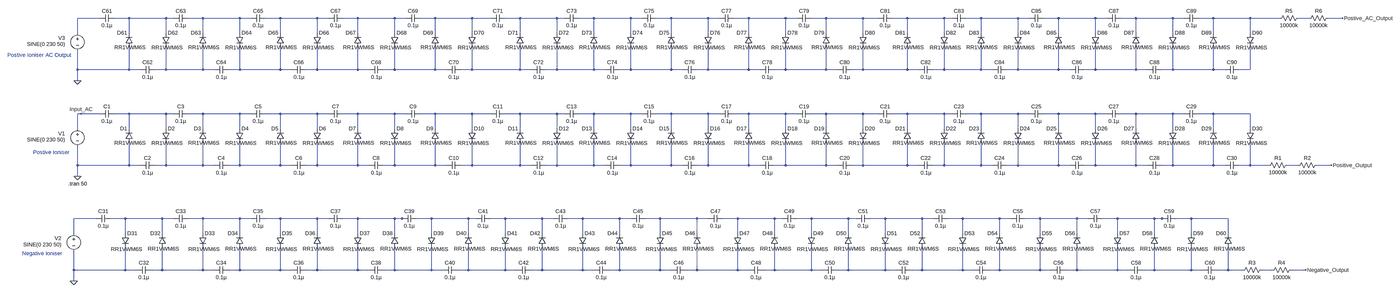
[diagram p0: schematic Ioniser_LTspice.asc, whole sheet]
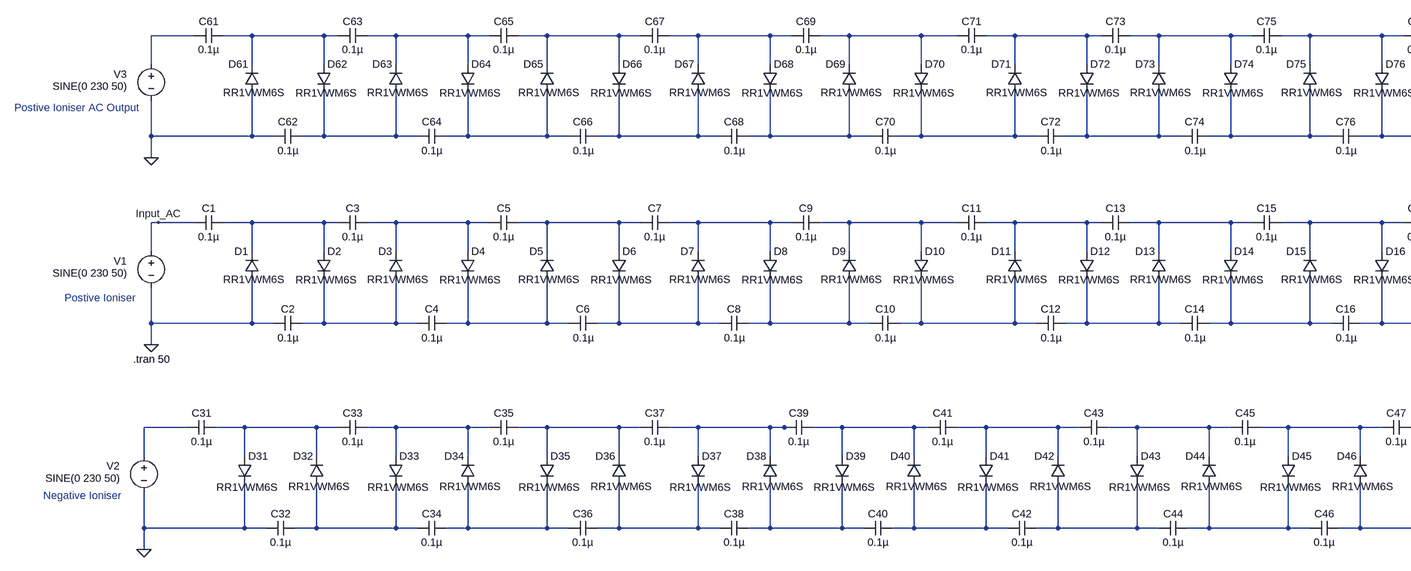
[diagram p1: schematic Ioniser_LTspice.asc, part, row 1 of 1, column 1 of 2]
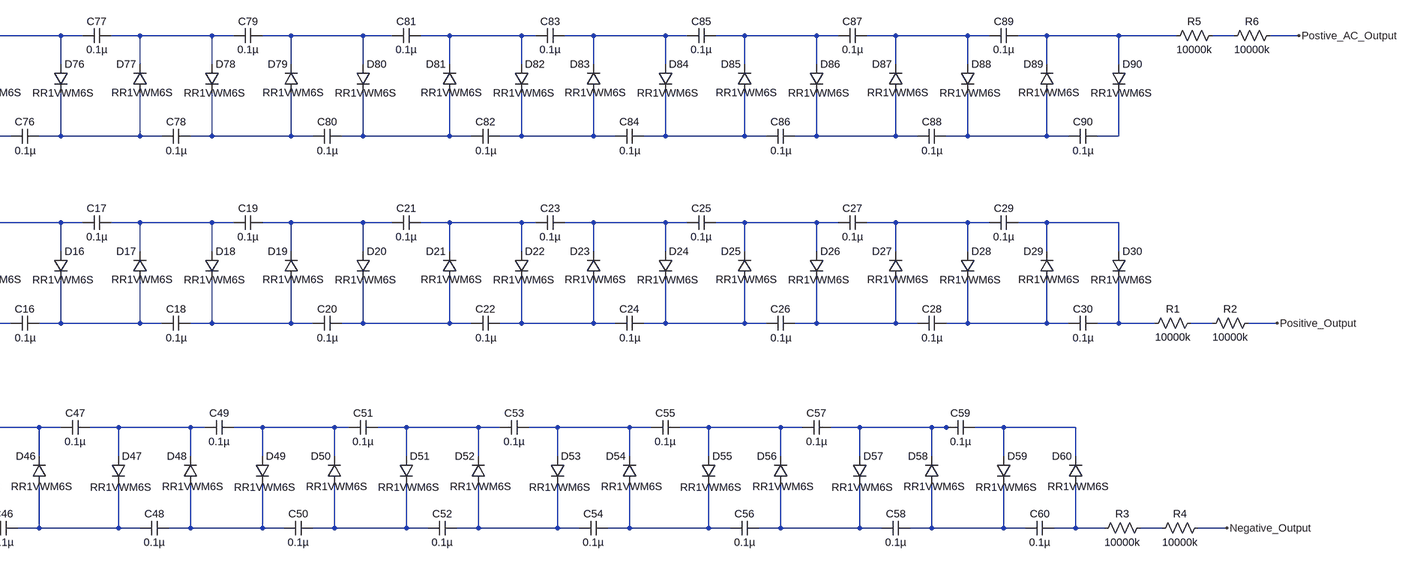
[diagram p2: schematic Ioniser_LTspice.asc, part, row 1 of 1, column 2 of 2]
* Ioniser_LTspice.asc
V1 Input_AC 0 SINE(0 230 50)
D1 0 N033 RR1VWM6S
C1 N033 Input_AC 0.1µ V=630 Irms=556m Rser=0.01433 Lser=0 mfg="KEMET" pn="C1812C104KBRAC" type="X7R"
D2 N033 N048 RR1VWM6S
C2 N048 0 0.1µ V=630 Irms=556m Rser=0.01433 Lser=0 mfg="KEMET" pn="C1812C104KBRAC" type="X7R"
D3 N048 N034 RR1VWM6S
C3 N034 N033 0.1µ V=630 Irms=556m Rser=0.01433 Lser=0 mfg="KEMET" pn="C1812C104KBRAC" type="X7R"
D4 N034 N049 RR1VWM6S
C4 N049 N048 0.1µ V=630 Irms=556m Rser=0.01433 Lser=0 mfg="KEMET" pn="C1812C104KBRAC" type="X7R"
D5 N049 N035 RR1VWM6S
C5 N035 N034 0.1µ V=630 Irms=556m Rser=0.01433 Lser=0 mfg="KEMET" pn="C1812C104KBRAC" type="X7R"
D6 N035 N050 RR1VWM6S
C6 N050 N049 0.1µ V=630 Irms=556m Rser=0.01433 Lser=0 mfg="KEMET" pn="C1812C104KBRAC" type="X7R"
D7 N050 N036 RR1VWM6S
C7 N036 N035 0.1µ V=630 Irms=556m Rser=0.01433 Lser=0 mfg="KEMET" pn="C1812C104KBRAC" type="X7R"
D8 N036 N051 RR1VWM6S
C8 N051 N050 0.1µ V=630 Irms=556m Rser=0.01433 Lser=0 mfg="KEMET" pn="C1812C104KBRAC" type="X7R"
R1 N063 N062 10000k
R2 Positive_Output N063 10000k
D9 N051 N037 RR1VWM6S
C9 N037 N036 0.1µ V=630 Irms=556m Rser=0.01433 Lser=0 mfg="KEMET" pn="C1812C104KBRAC" type="X7R"
D10 N037 N052 RR1VWM6S
C10 N052 N051 0.1µ V=630 Irms=556m Rser=0.01433 Lser=0 mfg="KEMET" pn="C1812C104KBRAC" type="X7R"
D11 N052 N038 RR1VWM6S
C11 N038 N037 0.1µ V=630 Irms=556m Rser=0.01433 Lser=0 mfg="KEMET" pn="C1812C104KBRAC" type="X7R"
D12 N038 N053 RR1VWM6S
C12 N053 N052 0.1µ V=630 Irms=556m Rser=0.01433 Lser=0 mfg="KEMET" pn="C1812C104KBRAC" type="X7R"
D13 N053 N039 RR1VWM6S
C13 N039 N038 0.1µ V=630 Irms=556m Rser=0.01433 Lser=0 mfg="KEMET" pn="C1812C104KBRAC" type="X7R"
D14 N039 N054 RR1VWM6S
C14 N054 N053 0.1µ V=630 Irms=556m Rser=0.01433 Lser=0 mfg="KEMET" pn="C1812C104KBRAC" type="X7R"
D15 N054 N040 RR1VWM6S
C15 N040 N039 0.1µ V=630 Irms=556m Rser=0.01433 Lser=0 mfg="KEMET" pn="C1812C104KBRAC" type="X7R"
D16 N040 N055 RR1VWM6S
C16 N055 N054 0.1µ V=630 Irms=556m Rser=0.01433 Lser=0 mfg="KEMET" pn="C1812C104KBRAC" type="X7R"
D17 N055 N041 RR1VWM6S
C17 N041 N040 0.1µ V=630 Irms=556m Rser=0.01433 Lser=0 mfg="KEMET" pn="C1812C104KBRAC" type="X7R"
D18 N041 N056 RR1VWM6S
C18 N056 N055 0.1µ V=630 Irms=556m Rser=0.01433 Lser=0 mfg="KEMET" pn="C1812C104KBRAC" type="X7R"
D19 N056 N042 RR1VWM6S
C19 N042 N041 0.1µ V=630 Irms=556m Rser=0.01433 Lser=0 mfg="KEMET" pn="C1812C104KBRAC" type="X7R"
D20 N042 N057 RR1VWM6S
C20 N057 N056 0.1µ V=630 Irms=556m Rser=0.01433 Lser=0 mfg="KEMET" pn="C1812C104KBRAC" type="X7R"
D21 N057 N043 RR1VWM6S
C21 N043 N042 0.1µ V=630 Irms=556m Rser=0.01433 Lser=0 mfg="KEMET" pn="C1812C104KBRAC" type="X7R"
D22 N043 N058 RR1VWM6S
C22 N058 N057 0.1µ V=630 Irms=556m Rser=0.01433 Lser=0 mfg="KEMET" pn="C1812C104KBRAC" type="X7R"
D23 N058 N044 RR1VWM6S
C23 N044 N043 0.1µ V=630 Irms=556m Rser=0.01433 Lser=0 mfg="KEMET" pn="C1812C104KBRAC" type="X7R"
D24 N044 N059 RR1VWM6S
C24 N059 N058 0.1µ V=630 Irms=556m Rser=0.01433 Lser=0 mfg="KEMET" pn="C1812C104KBRAC" type="X7R"
D25 N059 N045 RR1VWM6S
C25 N045 N044 0.1µ V=630 Irms=556m Rser=0.01433 Lser=0 mfg="KEMET" pn="C1812C104KBRAC" type="X7R"
D26 N045 N060 RR1VWM6S
C26 N060 N059 0.1µ V=630 Irms=556m Rser=0.01433 Lser=0 mfg="KEMET" pn="C1812C104KBRAC" type="X7R"
D27 N060 N046 RR1VWM6S
C27 N046 N045 0.1µ V=630 Irms=556m Rser=0.01433 Lser=0 mfg="KEMET" pn="C1812C104KBRAC" type="X7R"
D28 N046 N061 RR1VWM6S
C28 N061 N060 0.1µ V=630 Irms=556m Rser=0.01433 Lser=0 mfg="KEMET" pn="C1812C104KBRAC" type="X7R"
D29 N061 N047 RR1VWM6S
C29 N047 N046 0.1µ V=630 Irms=556m Rser=0.01433 Lser=0 mfg="KEMET" pn="C1812C104KBRAC" type="X7R"
D30 N047 N062 RR1VWM6S
C30 N062 N061 0.1µ V=630 Irms=556m Rser=0.01433 Lser=0 mfg="KEMET" pn="C1812C104KBRAC" type="X7R"
V2 N064 0 SINE(0 230 50)
D31 N065 0 RR1VWM6S
C31 N065 N064 0.1µ V=630 Irms=556m Rser=0.01433 Lser=0 mfg="KEMET" pn="C1812C104KBRAC" type="X7R"
C32 N080 0 0.1µ V=630 Irms=556m Rser=0.01433 Lser=0 mfg="KEMET" pn="C1812C104KBRAC" type="X7R"
D32 N080 N065 RR1VWM6S
D33 N066 N080 RR1VWM6S
C33 N066 N065 0.1µ V=630 Irms=556m Rser=0.01433 Lser=0 mfg="KEMET" pn="C1812C104KBRAC" type="X7R"
C34 N081 N080 0.1µ V=630 Irms=556m Rser=0.01433 Lser=0 mfg="KEMET" pn="C1812C104KBRAC" type="X7R"
D34 N081 N066 RR1VWM6S
D35 N067 N081 RR1VWM6S
C35 N067 N066 0.1µ V=630 Irms=556m Rser=0.01433 Lser=0 mfg="KEMET" pn="C1812C104KBRAC" type="X7R"
C36 N082 N081 0.1µ V=630 Irms=556m Rser=0.01433 Lser=0 mfg="KEMET" pn="C1812C104KBRAC" type="X7R"
D36 N082 N067 RR1VWM6S
D37 N068 N082 RR1VWM6S
C37 N068 N067 0.1µ V=630 Irms=556m Rser=0.01433 Lser=0 mfg="KEMET" pn="C1812C104KBRAC" type="X7R"
C38 N083 N082 0.1µ V=630 Irms=556m Rser=0.01433 Lser=0 mfg="KEMET" pn="C1812C104KBRAC" type="X7R"
D38 N083 N068 RR1VWM6S
D39 N069 N083 RR1VWM6S
C39 N069 N068 0.1µ V=630 Irms=556m Rser=0.01433 Lser=0 mfg="KEMET" pn="C1812C104KBRAC" type="X7R"
C40 N084 N083 0.1µ V=630 Irms=556m Rser=0.01433 Lser=0 mfg="KEMET" pn="C1812C104KBRAC" type="X7R"
D40 N084 N069 RR1VWM6S
D41 N070 N084 RR1VWM6S
C41 N070 N069 0.1µ V=630 Irms=556m Rser=0.01433 Lser=0 mfg="KEMET" pn="C1812C104KBRAC" type="X7R"
C42 N085 N084 0.1µ V=630 Irms=556m Rser=0.01433 Lser=0 mfg="KEMET" pn="C1812C104KBRAC" type="X7R"
D42 N085 N070 RR1VWM6S
D43 N071 N085 RR1VWM6S
C43 N071 N070 0.1µ V=630 Irms=556m Rser=0.01433 Lser=0 mfg="KEMET" pn="C1812C104KBRAC" type="X7R"
C44 N086 N085 0.1µ V=630 Irms=556m Rser=0.01433 Lser=0 mfg="KEMET" pn="C1812C104KBRAC" type="X7R"
D44 N086 N071 RR1VWM6S
D45 N072 N086 RR1VWM6S
C45 N072 N071 0.1µ V=630 Irms=556m Rser=0.01433 Lser=0 mfg="KEMET" pn="C1812C104KBRAC" type="X7R"
C46 N087 N086 0.1µ V=630 Irms=556m Rser=0.01433 Lser=0 mfg="KEMET" pn="C1812C104KBRAC" type="X7R"
D46 N087 N072 RR1VWM6S
D47 N073 N087 RR1VWM6S
C47 N073 N072 0.1µ V=630 Irms=556m Rser=0.01433 Lser=0 mfg="KEMET" pn="C1812C104KBRAC" type="X7R"
C48 N088 N087 0.1µ V=630 Irms=556m Rser=0.01433 Lser=0 mfg="KEMET" pn="C1812C104KBRAC" type="X7R"
D48 N088 N073 RR1VWM6S
D49 N074 N088 RR1VWM6S
C49 N074 N073 0.1µ V=630 Irms=556m Rser=0.01433 Lser=0 mfg="KEMET" pn="C1812C104KBRAC" type="X7R"
C50 N089 N088 0.1µ V=630 Irms=556m Rser=0.01433 Lser=0 mfg="KEMET" pn="C1812C104KBRAC" type="X7R"
D50 N089 N074 RR1VWM6S
D51 N075 N089 RR1VWM6S
C51 N075 N074 0.1µ V=630 Irms=556m Rser=0.01433 Lser=0 mfg="KEMET" pn="C1812C104KBRAC" type="X7R"
C52 N090 N089 0.1µ V=630 Irms=556m Rser=0.01433 Lser=0 mfg="KEMET" pn="C1812C104KBRAC" type="X7R"
D52 N090 N075 RR1VWM6S
D53 N076 N090 RR1VWM6S
C53 N076 N075 0.1µ V=630 Irms=556m Rser=0.01433 Lser=0 mfg="KEMET" pn="C1812C104KBRAC" type="X7R"
C54 N091 N090 0.1µ V=630 Irms=556m Rser=0.01433 Lser=0 mfg="KEMET" pn="C1812C104KBRAC" type="X7R"
D54 N091 N076 RR1VWM6S
D55 N077 N091 RR1VWM6S
C55 N077 N076 0.1µ V=630 Irms=556m Rser=0.01433 Lser=0 mfg="KEMET" pn="C1812C104KBRAC" type="X7R"
C56 N092 N091 0.1µ V=630 Irms=556m Rser=0.01433 Lser=0 mfg="KEMET" pn="C1812C104KBRAC" type="X7R"
D56 N092 N077 RR1VWM6S
D57 N078 N092 RR1VWM6S
C57 N078 N077 0.1µ V=630 Irms=556m Rser=0.01433 Lser=0 mfg="KEMET" pn="C1812C104KBRAC" type="X7R"
C58 N093 N092 0.1µ V=630 Irms=556m Rser=0.01433 Lser=0 mfg="KEMET" pn="C1812C104KBRAC" type="X7R"
D58 N093 N078 RR1VWM6S
D59 N079 N093 RR1VWM6S
C59 N079 N078 0.1µ V=630 Irms=556m Rser=0.01433 Lser=0 mfg="KEMET" pn="C1812C104KBRAC" type="X7R"
C60 N094 N093 0.1µ V=630 Irms=556m Rser=0.01433 Lser=0 mfg="KEMET" pn="C1812C104KBRAC" type="X7R"
D60 N094 N079 RR1VWM6S
R3 N095 N094 10000k
R4 Negative_Output N095 10000k
V3 N001 0 SINE(0 230 50)
D61 0 N002 RR1VWM6S
C61 N002 N001 0.1µ V=630 Irms=556m Rser=0.01433 Lser=0 mfg="KEMET" pn="C1812C104KBRAC" type="X7R"
D62 N002 N018 RR1VWM6S
C62 N018 0 0.1µ V=630 Irms=556m Rser=0.01433 Lser=0 mfg="KEMET" pn="C1812C104KBRAC" type="X7R"
D63 N018 N003 RR1VWM6S
C63 N003 N002 0.1µ V=630 Irms=556m Rser=0.01433 Lser=0 mfg="KEMET" pn="C1812C104KBRAC" type="X7R"
D64 N003 N019 RR1VWM6S
C64 N019 N018 0.1µ V=630 Irms=556m Rser=0.01433 Lser=0 mfg="KEMET" pn="C1812C104KBRAC" type="X7R"
D65 N019 N004 RR1VWM6S
C65 N004 N003 0.1µ V=630 Irms=556m Rser=0.01433 Lser=0 mfg="KEMET" pn="C1812C104KBRAC" type="X7R"
D66 N004 N020 RR1VWM6S
C66 N020 N019 0.1µ V=630 Irms=556m Rser=0.01433 Lser=0 mfg="KEMET" pn="C1812C104KBRAC" type="X7R"
D67 N020 N005 RR1VWM6S
C67 N005 N004 0.1µ V=630 Irms=556m Rser=0.01433 Lser=0 mfg="KEMET" pn="C1812C104KBRAC" type="X7R"
D68 N005 N021 RR1VWM6S
C68 N021 N020 0.1µ V=630 Irms=556m Rser=0.01433 Lser=0 mfg="KEMET" pn="C1812C104KBRAC" type="X7R"
R5 N017 N016 10000k
R6 Postive_AC_Output N017 10000k
D69 N021 N006 RR1VWM6S
C69 N006 N005 0.1µ V=630 Irms=556m Rser=0.01433 Lser=0 mfg="KEMET" pn="C1812C104KBRAC" type="X7R"
D70 N006 N022 RR1VWM6S
C70 N022 N021 0.1µ V=630 Irms=556m Rser=0.01433 Lser=0 mfg="KEMET" pn="C1812C104KBRAC" type="X7R"
D71 N022 N007 RR1VWM6S
C71 N007 N006 0.1µ V=630 Irms=556m Rser=0.01433 Lser=0 mfg="KEMET" pn="C1812C104KBRAC" type="X7R"
D72 N007 N023 RR1VWM6S
C72 N023 N022 0.1µ V=630 Irms=556m Rser=0.01433 Lser=0 mfg="KEMET" pn="C1812C104KBRAC" type="X7R"
D73 N023 N008 RR1VWM6S
C73 N008 N007 0.1µ V=630 Irms=556m Rser=0.01433 Lser=0 mfg="KEMET" pn="C1812C104KBRAC" type="X7R"
D74 N008 N024 RR1VWM6S
C74 N024 N023 0.1µ V=630 Irms=556m Rser=0.01433 Lser=0 mfg="KEMET" pn="C1812C104KBRAC" type="X7R"
D75 N024 N009 RR1VWM6S
C75 N009 N008 0.1µ V=630 Irms=556m Rser=0.01433 Lser=0 mfg="KEMET" pn="C1812C104KBRAC" type="X7R"
D76 N009 N025 RR1VWM6S
C76 N025 N024 0.1µ V=630 Irms=556m Rser=0.01433 Lser=0 mfg="KEMET" pn="C1812C104KBRAC" type="X7R"
D77 N025 N010 RR1VWM6S
C77 N010 N009 0.1µ V=630 Irms=556m Rser=0.01433 Lser=0 mfg="KEMET" pn="C1812C104KBRAC" type="X7R"
D78 N010 N026 RR1VWM6S
C78 N026 N025 0.1µ V=630 Irms=556m Rser=0.01433 Lser=0 mfg="KEMET" pn="C1812C104KBRAC" type="X7R"
D79 N026 N011 RR1VWM6S
C79 N011 N010 0.1µ V=630 Irms=556m Rser=0.01433 Lser=0 mfg="KEMET" pn="C1812C104KBRAC" type="X7R"
D80 N011 N027 RR1VWM6S
C80 N027 N026 0.1µ V=630 Irms=556m Rser=0.01433 Lser=0 mfg="KEMET" pn="C1812C104KBRAC" type="X7R"
D81 N027 N012 RR1VWM6S
C81 N012 N011 0.1µ V=630 Irms=556m Rser=0.01433 Lser=0 mfg="KEMET" pn="C1812C104KBRAC" type="X7R"
D82 N012 N028 RR1VWM6S
C82 N028 N027 0.1µ V=630 Irms=556m Rser=0.01433 Lser=0 mfg="KEMET" pn="C1812C104KBRAC" type="X7R"
D83 N028 N013 RR1VWM6S
C83 N013 N012 0.1µ V=630 Irms=556m Rser=0.01433 Lser=0 mfg="KEMET" pn="C1812C104KBRAC" type="X7R"
D84 N013 N029 RR1VWM6S
C84 N029 N028 0.1µ V=630 Irms=556m Rser=0.01433 Lser=0 mfg="KEMET" pn="C1812C104KBRAC" type="X7R"
D85 N029 N014 RR1VWM6S
C85 N014 N013 0.1µ V=630 Irms=556m Rser=0.01433 Lser=0 mfg="KEMET" pn="C1812C104KBRAC" type="X7R"
D86 N014 N030 RR1VWM6S
C86 N030 N029 0.1µ V=630 Irms=556m Rser=0.01433 Lser=0 mfg="KEMET" pn="C1812C104KBRAC" type="X7R"
D87 N030 N015 RR1VWM6S
C87 N015 N014 0.1µ V=630 Irms=556m Rser=0.01433 Lser=0 mfg="KEMET" pn="C1812C104KBRAC" type="X7R"
D88 N015 N031 RR1VWM6S
C88 N031 N030 0.1µ V=630 Irms=556m Rser=0.01433 Lser=0 mfg="KEMET" pn="C1812C104KBRAC" type="X7R"
D89 N031 N016 RR1VWM6S
C89 N016 N015 0.1µ V=630 Irms=556m Rser=0.01433 Lser=0 mfg="KEMET" pn="C1812C104KBRAC" type="X7R"
D90 N016 N032 RR1VWM6S
C90 N032 N031 0.1µ V=630 Irms=556m Rser=0.01433 Lser=0 mfg="KEMET" pn="C1812C104KBRAC" type="X7R"
.model D D
.lib standard.dio
.tran 50
* Postive Ioniser
* Negative Ioniser
* Postive Ioniser AC Output
.backanno
.end